# EasyEDA Pro project New Project_2026-01-03_13-52-35.eprj

# Schematic Schematic1
Board Name: Board1; Create Date: 2026-01-03; Page Name: P1; Project Name: New Project_2026-01-03_13-52-35; Schematic Name: Schematic1; Update Date: 2026-01-03; Company: EasyEDA.com; Page Size: A4; Version: V1.0
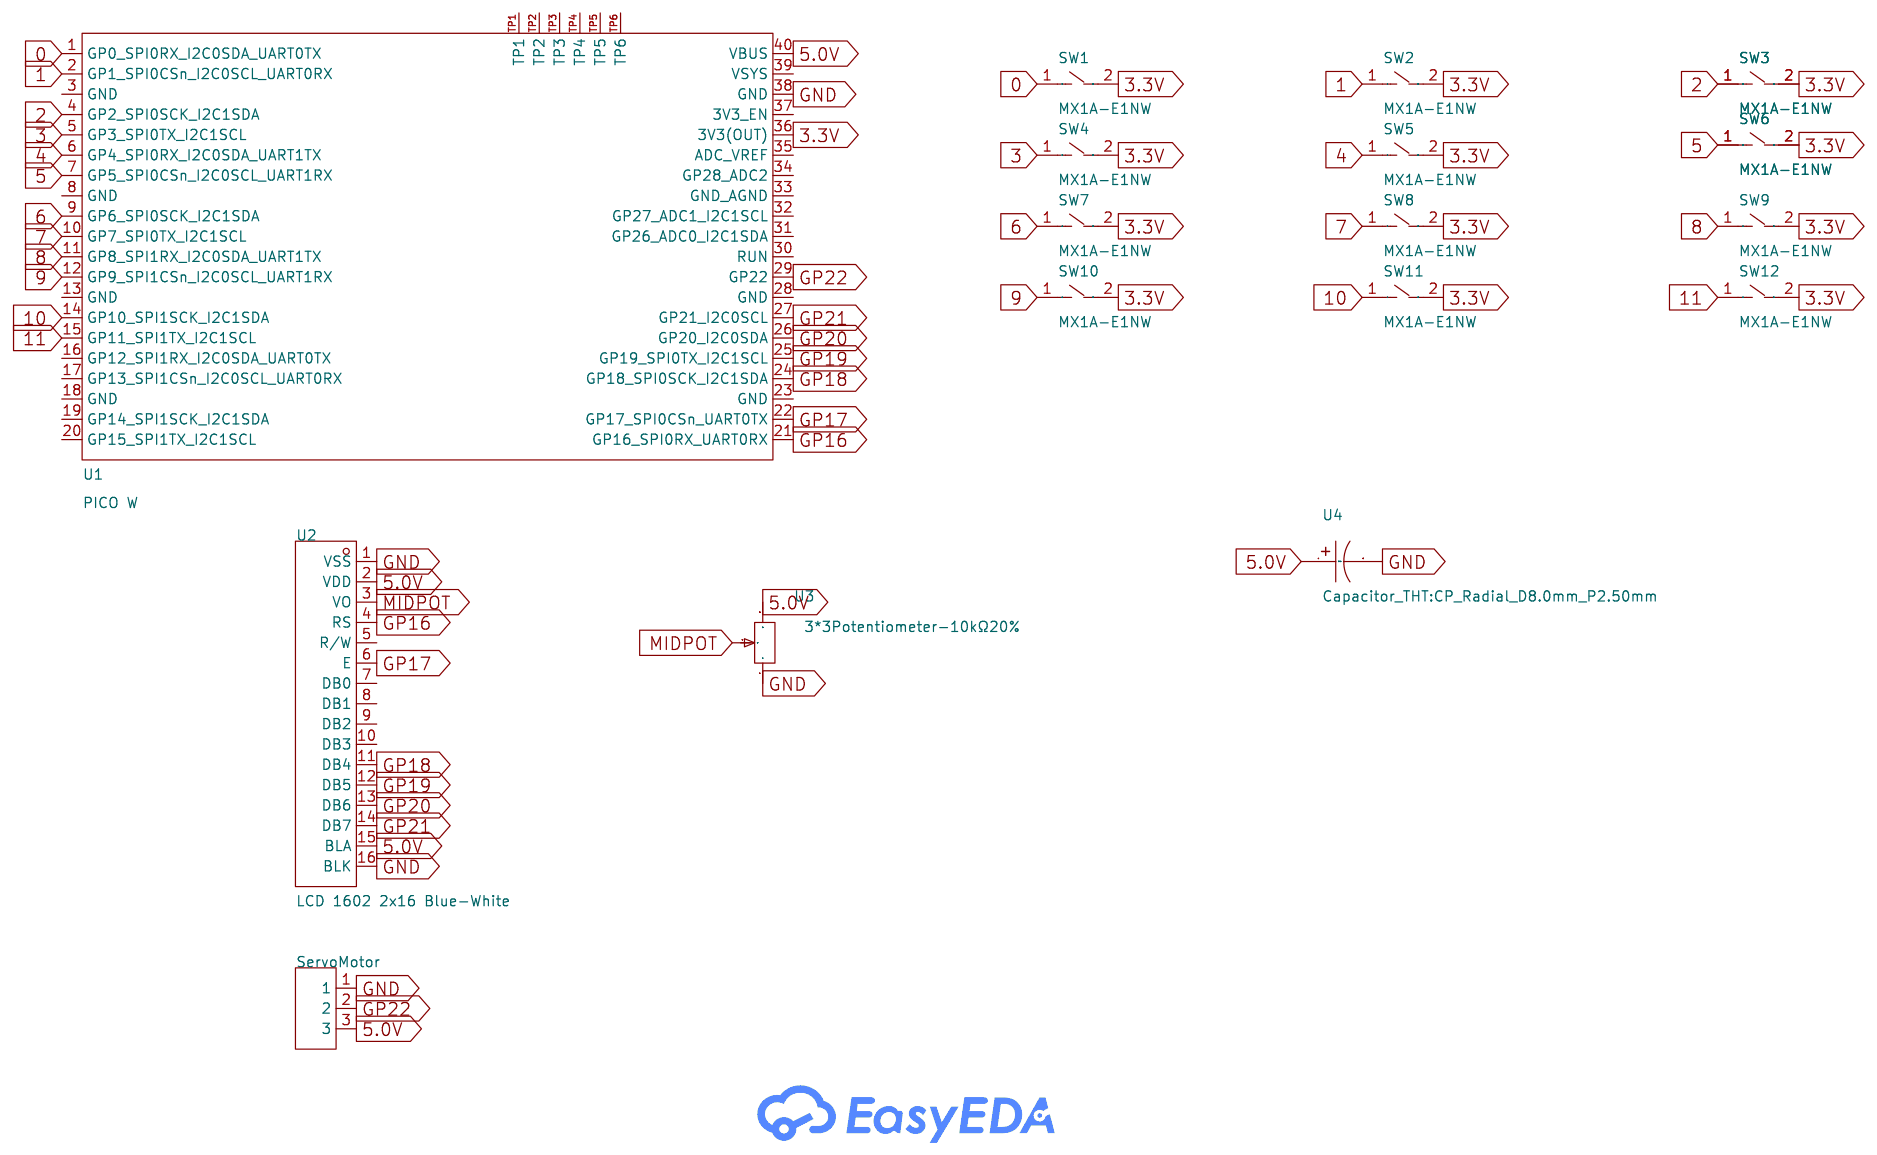
[diagram p0: schematic sheet]

## Parts
ServoMotor  -  [HDR-TH_3P-P2.54-V-M]
SW1  MX1A-E1NW  [SW-TH_MX1A-E1NW]
SW2  MX1A-E1NW  [SW-TH_MX1A-E1NW]
SW3  MX1A-E1NW  [SW-TH_MX1A-E1NW]
SW4  MX1A-E1NW  [SW-TH_MX1A-E1NW]
SW5  MX1A-E1NW  [SW-TH_MX1A-E1NW]
SW6  MX1A-E1NW  [SW-TH_MX1A-E1NW]
SW7  MX1A-E1NW  [SW-TH_MX1A-E1NW]
SW8  MX1A-E1NW  [SW-TH_MX1A-E1NW]
SW9  MX1A-E1NW  [SW-TH_MX1A-E1NW]
SW10  MX1A-E1NW  [SW-TH_MX1A-E1NW]
SW11  MX1A-E1NW  [SW-TH_MX1A-E1NW]
SW12  MX1A-E1NW  [SW-TH_MX1A-E1NW]
U1  PICO W  [COMM-SMD_L51.0-W21.0-P2.54_PICOW]
U2  LCD 1602 2x16 Blue-White  [LCD-TH_LCD-1602-2X16-BLUE-WHITE]
U3  3*3Potentiometer-10kΩ20%  [RES-ADJ-SMD_VG039NCH]
U4  Capacitor_THT:CP_Radial_D8.0mm_P2.50mm  [CAP-TH_BD8.0-P3.50-D0.6-FD]

## Library data of the parts
ServoMotor = HDR-M_2.54_1x3P: Supplier Footprint: Through
SW1-SW12 = MX1A-E1NW: Supplier Part: C5120587; Manufacturer: CHERRY; Supplier Footprint: 插件; JLCPCB Part Class: Extended Part; Datasheet: https://item.szlcsc.com/datasheet/MX1A-E1NW/5705589.html; Supplier: LCSC
U1 = PICO W: Supplier Part: C7203003; Manufacturer: Raspberry Pi(树莓派); JLCPCB Part Class: Extended Part; Datasheet: https://item.szlcsc.com/datasheet/PICO%2520W/8170961.html; Supplier: LCSC
U2 = LCD 1602 2x16 Blue-White: Supplier Part: C17667002; Manufacturer: Universal Microelectronics; JLCPCB Part Class: Extended Part; Datasheet: https://atta.szlcsc.com/upload/public/pdf/source/231023/C17408327-0b50fa3f727f71b832ab37652c22c163.pdf; Supplier: LCSC; Main Control Chip: HD44780
U3 = 3*3Potentiometer-10kΩ20%: Supplier Part: C9900010776; Supplier Footprint: SMD-3P; JLCPCB Part Class: Extended Part; Supplier: LCSC
U4 = Capacitor_THT:CP_Radial_D8.0mm_P2.50mm: Supplier Part: C9900016268; Supplier Footprint: 470uF_25V; JLCPCB Part Class: Extended Part; Supplier: LCSC

## Nets
3.3V: SW1.2 SW2.2 SW3.2 SW4.2 SW5.2 SW6.2 SW7.2 SW8.2 SW9.2 SW10.2 SW11.2 SW12.2 U1.36(3V3(OUT))
5.0V: ServoMotor.3 U1.40(VBUS) U2.2(VDD) U2.15(BLA) U3.3 U4.1
GND: ServoMotor.1 U1.38(GND) U2.1(VSS) U2.16(BLK) U3.1 U4.2
0: SW1.1 U1.1(GP0_SPI0RX_I2C0SDA_UART0TX)
1: SW2.1 U1.2(GP1_SPI0CSn_I2C0SCL_UART0RX)
2: SW3.1 U1.4(GP2_SPI0SCK_I2C1SDA)
3: SW4.1 U1.5(GP3_SPI0TX_I2C1SCL)
4: SW5.1 U1.6(GP4_SPI0RX_I2C0SDA_UART1TX)
5: SW6.1 U1.7(GP5_SPI0CSn_I2C0SCL_UART1RX)
6: SW7.1 U1.9(GP6_SPI0SCK_I2C1SDA)
7: SW8.1 U1.10(GP7_SPI0TX_I2C1SCL)
8: SW9.1 U1.11(GP8_SPI1RX_I2C0SDA_UART1TX)
9: SW10.1 U1.12(GP9_SPI1CSn_I2C0SCL_UART1RX)
10: SW11.1 U1.14(GP10_SPI1SCK_I2C1SDA)
11: SW12.1 U1.15(GP11_SPI1TX_I2C1SCL)
GP16: U1.21(GP16_SPI0RX_UART0RX) U2.4(RS)
GP17: U1.22(GP17_SPI0CSn_UART0TX) U2.6(E)
GP18: U1.24(GP18_SPI0SCK_I2C1SDA) U2.11(DB4)
GP19: U1.25(GP19_SPI0TX_I2C1SCL) U2.12(DB5)
GP20: U1.26(GP20_I2C0SDA) U2.13(DB6)
GP21: U1.27(GP21_I2C0SCL) U2.14(DB7)
GP22: ServoMotor.2 U1.29(GP22)
MIDPOT: U2.3(VO) U3.2

Not connected (* = marked no-connect by the designer): U1 3(GND) 8(GND) 13(GND) 16(GP12_SPI1RX_I2C0SDA_UART0TX) 17(GP13_SPI1CSn_I2C0SCL_UART0RX) 18(GND) 19(GP14_SPI1SCK_I2C1SDA) 20(GP15_SPI1TX_I2C1SCL) 23(GND) 28(GND) 30(RUN) 31(GP26_ADC0_I2C1SDA) 32(GP27_ADC1_I2C1SCL) 33(GND_AGND) 34(GP28_ADC2) 35(ADC_VREF) 37(3V3_EN) 39(VSYS) TP1 TP2 TP3 TP4 TP5 TP6; U2 5(R/W) 7(DB0) 8(DB1) 9(DB2) 10(DB3)

# Board PCB1
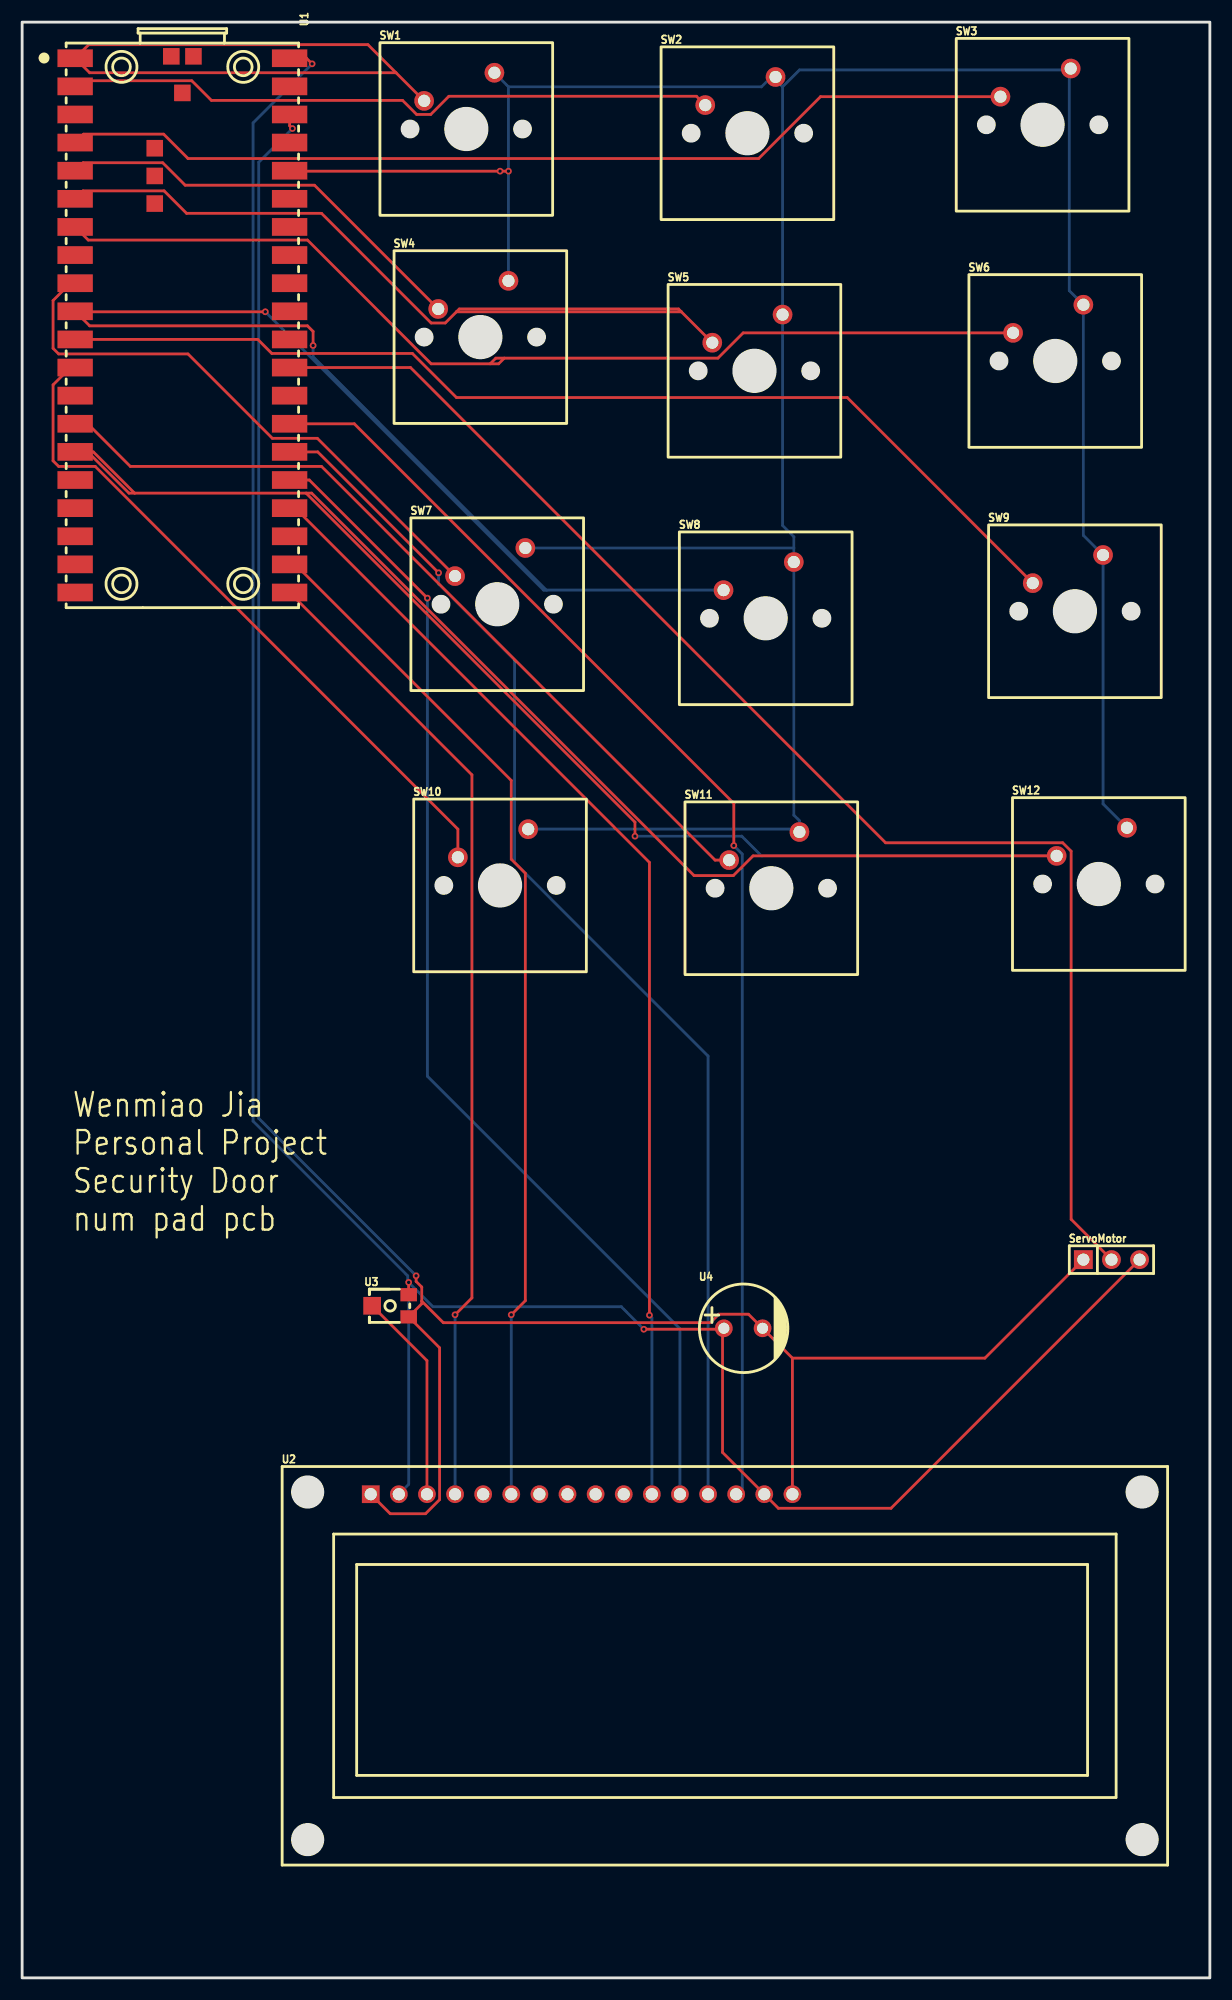
[diagram p1: board, top side]
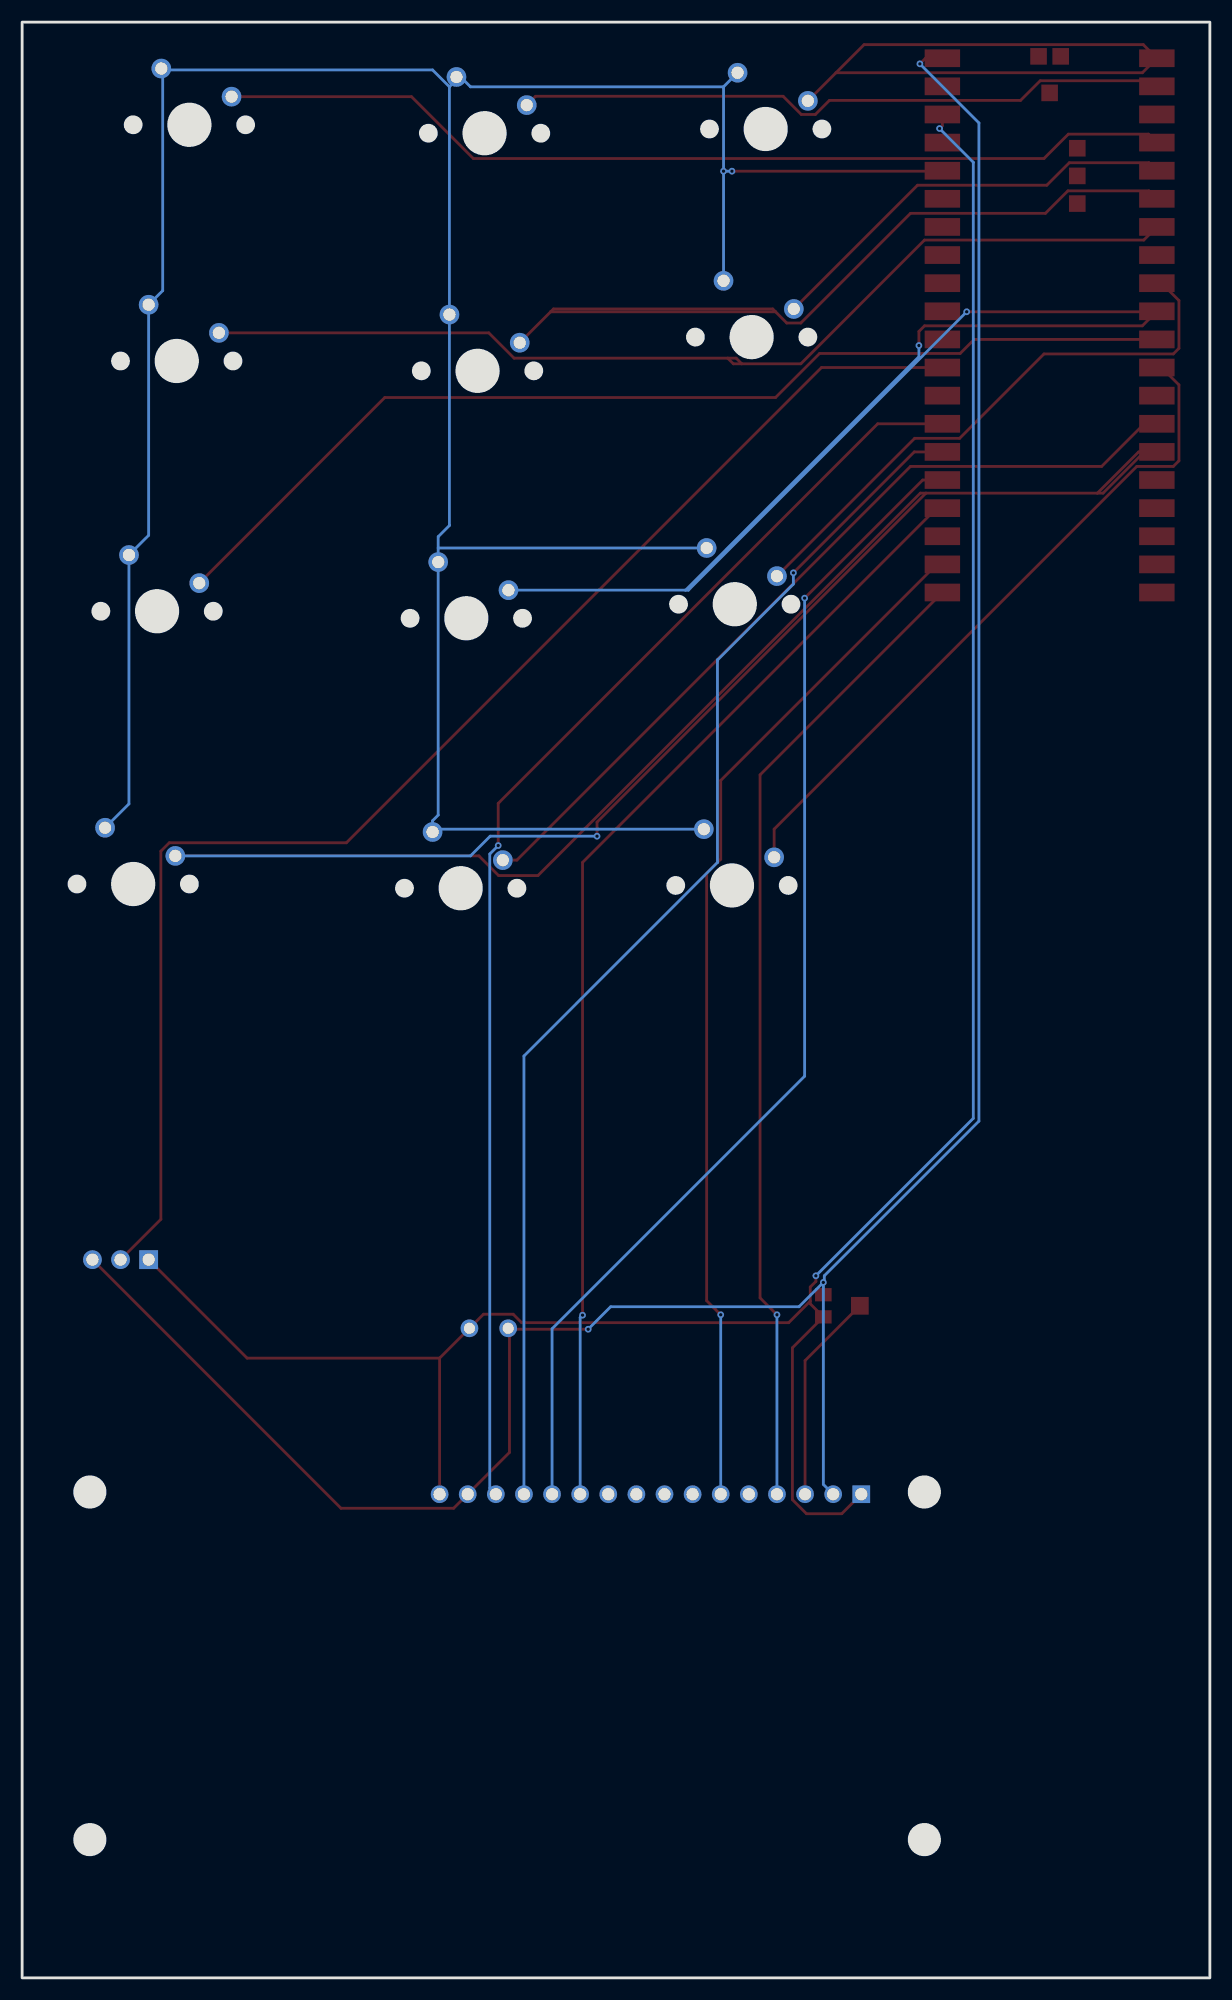
[diagram p2: board, bottom side, seen from below]

Outline 107.31 x 176.66 mm; copper layers: Top Layer, Bottom Layer. Coordinates in mm from the lower left corner of the outline.
Outline path: rectangle 0,176.66 107.31,0
Stack: Top Layer 0.035mm / Dielectric1 1.51mm FR4 er 4.5 / Bottom Layer 0.035mm

## Design rules (mm)
template: JLCPCB Capability(Two Layers Board)
spacing copperThickness1oz (default): track to track 0.102, other pairs 0.152 to 0.3
spacing copperThickness2oz: track to track 0.203, other pairs 0.152 to 0.3
track width copperThickness1oz (default): min 0.127, default 0.254, max 2.54
track width copperThickness2oz: min 0.203, default 0.254, max 2.54
differential pair differentialPair (default): width min 0.127, default 0.254, max 2.54; gap min 0.152, default 0.152
via viaSize (default): diameter min 0.5, default 0.61, max 10; hole min 0.3, default 0.305, max 6.3

## Placement (name value [footprint] x y rotation side)
ServoMotor  -  [HDR-TH_3P-P2.54-V-M]  98.42 64.88 0 top
SW1  MX1A-E1NW  [SW-TH_MX1A-E1NW]  39.5 170.81 0 top
SW2  MX1A-E1NW  [SW-TH_MX1A-E1NW]  64.9 170.43 0 top
SW3  MX1A-E1NW  [SW-TH_MX1A-E1NW]  91.57 171.2 0 top
SW4  MX1A-E1NW  [SW-TH_MX1A-E1NW]  40.77 152.02 0 top
SW5  MX1A-E1NW  [SW-TH_MX1A-E1NW]  65.53 148.97 0 top
SW6  MX1A-E1NW  [SW-TH_MX1A-E1NW]  92.71 149.86 0 top
SW7  MX1A-E1NW  [SW-TH_MX1A-E1NW]  42.29 127.89 0 top
SW8  MX1A-E1NW  [SW-TH_MX1A-E1NW]  66.55 126.62 0 top
SW9  MX1A-E1NW  [SW-TH_MX1A-E1NW]  94.49 127.25 0 top
SW10  MX1A-E1NW  [SW-TH_MX1A-E1NW]  42.55 102.49 0 top
SW11  MX1A-E1NW  [SW-TH_MX1A-E1NW]  67.06 102.23 0 top
SW12  MX1A-E1NW  [SW-TH_MX1A-E1NW]  96.65 102.62 0 top
U1  PICO W  [COMM-SMD_L51.0-W21.0-P2.54_PICOW]  14.48 149.35 270 top
U2  LCD 1602 2x16 Blue-White  [LCD-TH_LCD-1602-2X16-BLUE-WHITE]  50.55 43.69 0 top
U3  3*3Potentiometer-10kΩ20%  [RES-ADJ-SMD_VG039NCH]  33.27 60.71 0 top
U4  Capacitor_THT:CP_Radial_D8.0mm_P2.50mm  [CAP-TH_BD8.0-P3.50-D0.6-FD]  65.15 58.67 0 top

## Footprints (pads in the part's own frame, mm; a bottom-side part is the same pattern mirrored in y, then rotated)
CAP-TH_BD8.0-P3.50-D0.6-FD
  round 1.6 hole 1: 1(-1.75,0) 2(1.75,0)
COMM-SMD_L51.0-W21.0-P2.54_PICOW
  rect 1.6x3.2 smd: 1(-24.045,-9.69) 2(-21.505,-9.69) 3(-18.965,-9.69) 4(-16.425,-9.69) 5(-13.885,-9.69) 6(-11.345,-9.69) 7(-8.805,-9.69) 8(-6.265,-9.69) 9(-3.725,-9.69) 10(-1.185,-9.69) 11(1.355,-9.69) 12(3.895,-9.69) 13(6.435,-9.69) 14(8.975,-9.69) 15(11.515,-9.69) 16(14.055,-9.69) 17(16.595,-9.69) 18(19.135,-9.69) 19(21.675,-9.69) 20(24.215,-9.69) 21(24.215,9.69) 22(21.675,9.69) 23(19.135,9.69) 24(16.595,9.69) 25(14.055,9.69) 26(11.515,9.69) 27(8.975,9.69) 28(6.435,9.69) 29(3.895,9.69) 30(1.355,9.69) 31(-1.185,9.69) 32(-3.725,9.69) 33(-6.265,9.69) 34(-8.805,9.69) 35(-11.345,9.69) 36(-13.885,9.69) 37(-16.425,9.69) 38(-18.965,9.69) 39(-21.505,9.69) 40(-24.045,9.69)
  rect 1.5x1.5 smd: TP1(-20.915,0) TP2(-24.215,1) TP3(-24.215,-1) TP4(-15.915,-2.499) TP5(-13.415,-2.499) TP6(-10.915,-2.499)
HDR-TH_3P-P2.54-V-M
  rect 1.7x1.7 hole 1.1: 1(-2.54,0)
  round 1.7 hole 1.1: 2(0,0) 3(2.54,0)
LCD-TH_LCD-1602-2X16-BLUE-WHITE
  rect 1.6x1.6 hole 1.1: 1(-19.05,0)
  round 1.6 hole 1.1: 2(-16.51,0) 3(-13.97,0) 4(-11.43,0) 5(-8.89,0) 6(-6.35,0) 7(-3.81,0) 8(-1.27,0) 9(1.27,0) 10(3.81,0) 11(6.35,0) 12(8.89,0) 13(11.43,0) 14(13.97,0) 15(16.51,0) 16(19.05,0)
RES-ADJ-SMD_VG039NCH
  rect 1.5x1.2 smd: 1(1.65,-1) 3(1.65,1)
  rect 1.6x1.6 smd: 2(-1.65,0)
SW-TH_MX1A-E1NW
  round 1.778 hole 1.1: 1(-3.175,-1.27) 2(3.175,1.27)

## Nets
As in the schematic.

Pads without a net: U1 3 8 13 16 17 18 19 20 23 28 30 31 32 33 34 35 37 39 TP1 TP2 TP3 TP4 TP5 TP6; U2 5 7 8 9 10

## Via types
v1: diameter 0.61, hole 0.305, Top Layer to Bottom Layer, 16 vias

## Routing (per net, layer and track width the routed paths; a pad name or vN(x,y) marks a point on that pad's centre or on a via; arc(x,y) is an arc through that point)
3.3V: length 279.5
  Top Layer w0.254: v1(43.94,163.19) v1(43.18,163.19) 24.21,163.19 U1.36
  Bottom Layer w0.254: 69.72,129.16 45.47,129.16 ; 69.72,129.16 SW8.2 69.72,105.03 70.23,104.52 70.23,103.76 ; 69.72,129.16 69.72,130.18 68.71,131.19 SW5.2 68.71,170.81 ; v1(43.94,163.19) v1(43.18,163.19) ; v1(43.94,163.19) 43.94,170.81 ; v1(43.94,163.19) 43.94,153.29 ; 68.71,170.81 70.23,172.34 94.61,172.34 ; 68.71,170.81 67.95,171.58 ; 67.95,171.58 SW2.2 ; 67.95,171.58 67.56,171.58 66.8,170.81 43.94,170.81 ; SW1.2 43.94,170.81 ; 94.61,172.34 SW3.2 ; 94.61,172.34 94.61,152.4 SW6.2 95.89,130.3 SW9.2 97.66,106.05 99.82,103.89 ; 70.23,103.76 SW10.2 ; 70.23,103.76 SW11.2
5.0V: length 231.4
  Top Layer w0.254: v1(26.2,172.89) 25.69,173.4 U1.40 ; 63.28,58.59 63.28,47.46 U2.15 68.33,42.42 78.51,42.42 ServoMotor.3 ; 63.28,58.59 v1(56.17,58.59) ; 63.28,58.59 U4.1 ; v1(34.92,62.82) U3.3
  Bottom Layer w0.254: 34.04,43.69 34.92,44.58 v1(34.92,62.82) ; v1(34.92,62.82) 37.12,60.62 54.14,60.62 v1(56.17,58.59) ; v1(34.92,62.82) 34.84,62.91 34.84,63.41 20.87,77.38 20.87,167.56 v1(26.2,172.89)
GND: length 220.2
  Top Layer w0.254: ServoMotor.1 86.99,55.98 69.6,55.98 ; U1.38 24.17,167.3 v1(24.42,167.05) ; 69.6,55.98 U4.2 65.63,59.94 62.95,59.94 62.18,59.18 38.05,59.18 36.11,61.13 ; 69.6,55.98 U2.16 ; 36.11,61.13 36.11,62.4 35.6,62.91 v1(35.6,63.41) ; 36.11,61.13 36.11,60.89 U3.1 37.72,56.91 37.72,43.2 36.45,41.93 33.26,41.93 U2.1
  Bottom Layer w0.254: v1(35.6,63.41) 21.37,77.64 21.37,164 v1(24.42,167.05)
0: length 63.7
  Top Layer w0.254: SW1.1 33.78,172.09 ; 33.78,172.09 31.24,174.62 6.02,174.62 U1.1 6.1,172.09 33.78,172.09
1: length 59.4
  Top Layer w0.254: U1.2 5.3,171.37 15.33,171.37 17.1,169.59 34.37,169.59 35.64,168.32 36.92,168.32 38.56,169.96 60.93,169.96 SW2.1
2: length 87.1
  Top Layer w0.254: U1.4 5.55,166.54 12.78,166.54 14.99,164.34 66.55,164.34 72.14,169.93 88.39,169.93
3: length 38.6
  Top Layer w0.254: U1.5 5.51,163.96 12.7,163.96 14.73,161.93 26.42,161.93 SW4.1
4: length 84.9
  Top Layer w0.254: SW5.1 59.56,150.5 ; 59.56,150.5 39.24,150.5 ; 59.56,150.5 59.31,150.75 39.5,150.75 39.24,150.5 ; 39.24,150.5 38.23,149.48 36.96,149.48 27.05,159.38 14.86,159.38 12.83,161.42 5.51,161.42 U1.6
5: length 92.5
  Top Layer w0.254: 43.56,146.3 42.8,146.3 42.29,145.8 ; 43.56,146.3 62.86,146.3 65.15,148.59 SW6.1 ; 43.56,146.3 43.05,145.8 42.29,145.8 ; 42.29,145.8 36.96,145.8 25.78,156.97 5.97,156.97 U1.7
6: length 51.8
  Top Layer w0.254: U1.9 4.36,153.08 2.79,151.51 2.79,147.19 3.3,146.69 14.99,146.69 22.61,139.06 26.67,139.06 SW7.1
7: length 123.3
  Top Layer w0.254: v1(26.29,147.45) 26.29,148.72 25.78,149.22 6.1,149.22 4.83,150.5 ; 4.83,150.5 U1.10 ; 4.83,150.5 v1(21.97,150.5)
  Bottom Layer w0.254: v1(21.97,150.5) 47.12,125.35 47.37,125.35 ; v1(26.29,147.45) 26.29,146.43 47.37,125.35 ; 47.37,125.35 SW8.1
8: length 95.6
  Top Layer w0.254: SW9.1 74.55,142.75 39.24,142.75 35.26,146.73 22.56,146.73 21.29,148 U1.11
9: length 62.4
  Top Layer w0.254: U1.12 4.75,145.41 4.32,145.41 2.79,143.89 2.79,137.03 3.3,136.53 6.6,136.53 39.37,103.76 SW10.1
10: length 75.4
  Top Layer w0.254: U1.14 4.83,140.34 5.97,140.34 9.78,136.53 27.05,136.53 62.61,100.97 SW11.1
11: length 193.2
  Top Layer w0.254: 10.16,134.11 6.44,137.84 5.93,137.84 ; 10.16,134.11 9.65,134.11 5.93,137.84 ; 10.16,134.11 25.65,134.11 ; 5.93,137.84 U1.15 ; 25.65,134.11 26.16,134.11 60.71,99.57 64.26,99.57 66.04,101.35 SW12.1 ; 25.65,134.11 55.37,104.39 v1(55.37,103.12)
  Bottom Layer w0.254: v1(55.37,103.12) 65.02,103.12 66.8,101.35 SW12.1
GP16: length 88.9
  Top Layer w0.254: v1(39.12,59.9) 40.64,61.42 40.64,108.66 U1.21
  Bottom Layer w0.254: v1(39.12,59.9) U2.4
GP17: length 93.6
  Top Layer w0.254: U1.22 24.68,127.68 44.2,108.16 44.2,101.05 45.47,99.77 45.47,61.17 v1(44.2,59.9)
  Bottom Layer w0.254: v1(44.2,59.9) U2.6
GP18: length 102.9
  Top Layer w0.254: v1(56.68,59.86) 56.68,100.75 24.68,132.76 U1.24
  Bottom Layer w0.254: v1(56.68,59.86) 56.9,59.64 U2.11
GP19: length 107.3
  Top Layer w0.254: v1(36.61,124.63) 25.95,135.3 U1.25
  Bottom Layer w0.254: U2.12 59.44,58.63 36.61,81.45 v1(36.61,124.63)
GP20: length 111.3
  Top Layer w0.254: U1.26 26.71,137.84 v1(37.63,126.91)
  Bottom Layer w0.254: U2.13 61.98,83.27 44.49,100.75 44.49,119.04 37.63,125.9 v1(37.63,126.91)
GP21: length 117.3
  Top Layer w0.254: v1(64.3,102.28) 64.3,106.09 30.01,140.38 U1.27
  Bottom Layer w0.254: v1(64.3,102.28) 65.06,101.52 65.06,44.23 U2.14
GP22: length 127.1
  Top Layer w0.254: U1.29 35.09,145.46 78.02,102.53 94.02,102.53 94.78,101.77 94.78,68.52 ServoMotor.2
MIDPOT: length 19.1
  Top Layer w0.254: 31.62,60.71 36.58,55.75 U2.3

## Text on the board
Top Silkscreen Layer: Wenmiao Jia / Personal Project / Security Door / num pad pcb
